# Altium schematic sheet ADC.SCHDOC: 8+2 Acquisition Board
size B; Engineer: Eric Jonas (jonas@mwl.mit.edu); Organization: PILM, MIT; Address1: 46-5227; Address2: 43 Vassar St.; Address3: Cambridge, MA 02139; Address4: Australia 2086
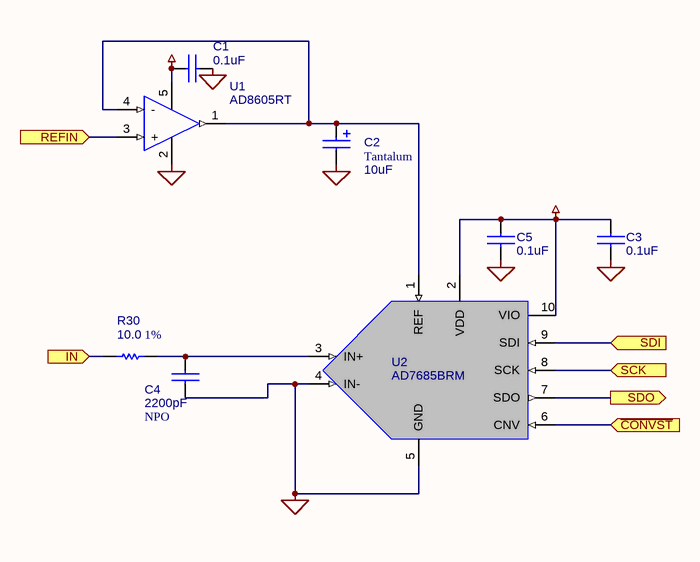
[diagram p0: ADC.SCHDOC]

## Parts
C1  value 0.1uF  [0603]  (hidden comment: CAPACITOR)
C2  value 10uF  [3216]  (hidden comment: Tantalum)
C3  value 0.1uF  [0603]  (hidden comment: CAPACITOR)
C4  value 2200pF  Type: NPO  [0603]  (hidden comment: CAPACITOR)
C5  value 0.1uF  [0603]  (hidden comment: CAPACITOR)
R30  value 10.0  Tolerance: 1%  [0603]  (hidden comment: RESISTOR)
U1  AD8605RT  [SOT-5]
U2  AD7685BRM  [AD RM-10]

## Ports
IN (in), REFIN (in), SCK (in), SDI (in), SDO (out), ~{CONVST} (in)

## Nets
AGND: C1.2 C2.2 C3.1 C4.1 C5.1 U1.2(-Vs) U2.4(IN-) U2.5(GND)
AVDD: C1.1 C3.2 C5.2 U1.5(+Vs) U2.2(VDD) U2.10(VIO)
~{CONVST}: U2.6(CNV) ; port ~{CONVST}
IN: R30.1 ; port IN
REFIN: U1.3(+) ; port REFIN
SCK: U2.8(SCK) ; port SCK
SDI: U2.9(SDI) ; port SDI
SDO: U2.7(SDO) ; port SDO
NetC2_1: C2.1 U1.1(Out) U1.4(-) U2.1(REF)
NetC4_2: C4.2 R30.2 U2.3(IN+)

## Notes on the sheet
- Title:
- Engineer:
- Date:
- Revision:
- Sheet
- of
- File:

## Library data of the parts
C1 C3-C5 = CAPACITOR: Standard Capacitor
C2 = POLCAP: Standard Capacitor; Type: Tantalum
R30 = RESISTOR: Standard Passive Resistor
U1 = AD8605RT: Analog Devices Precision Low Noise CMOS Rail-to-Rail Input/Output Operational Amplifier
U2 = AD7685: AD 16-bit 250 kSPS ADC; Vendor: Analog Devices